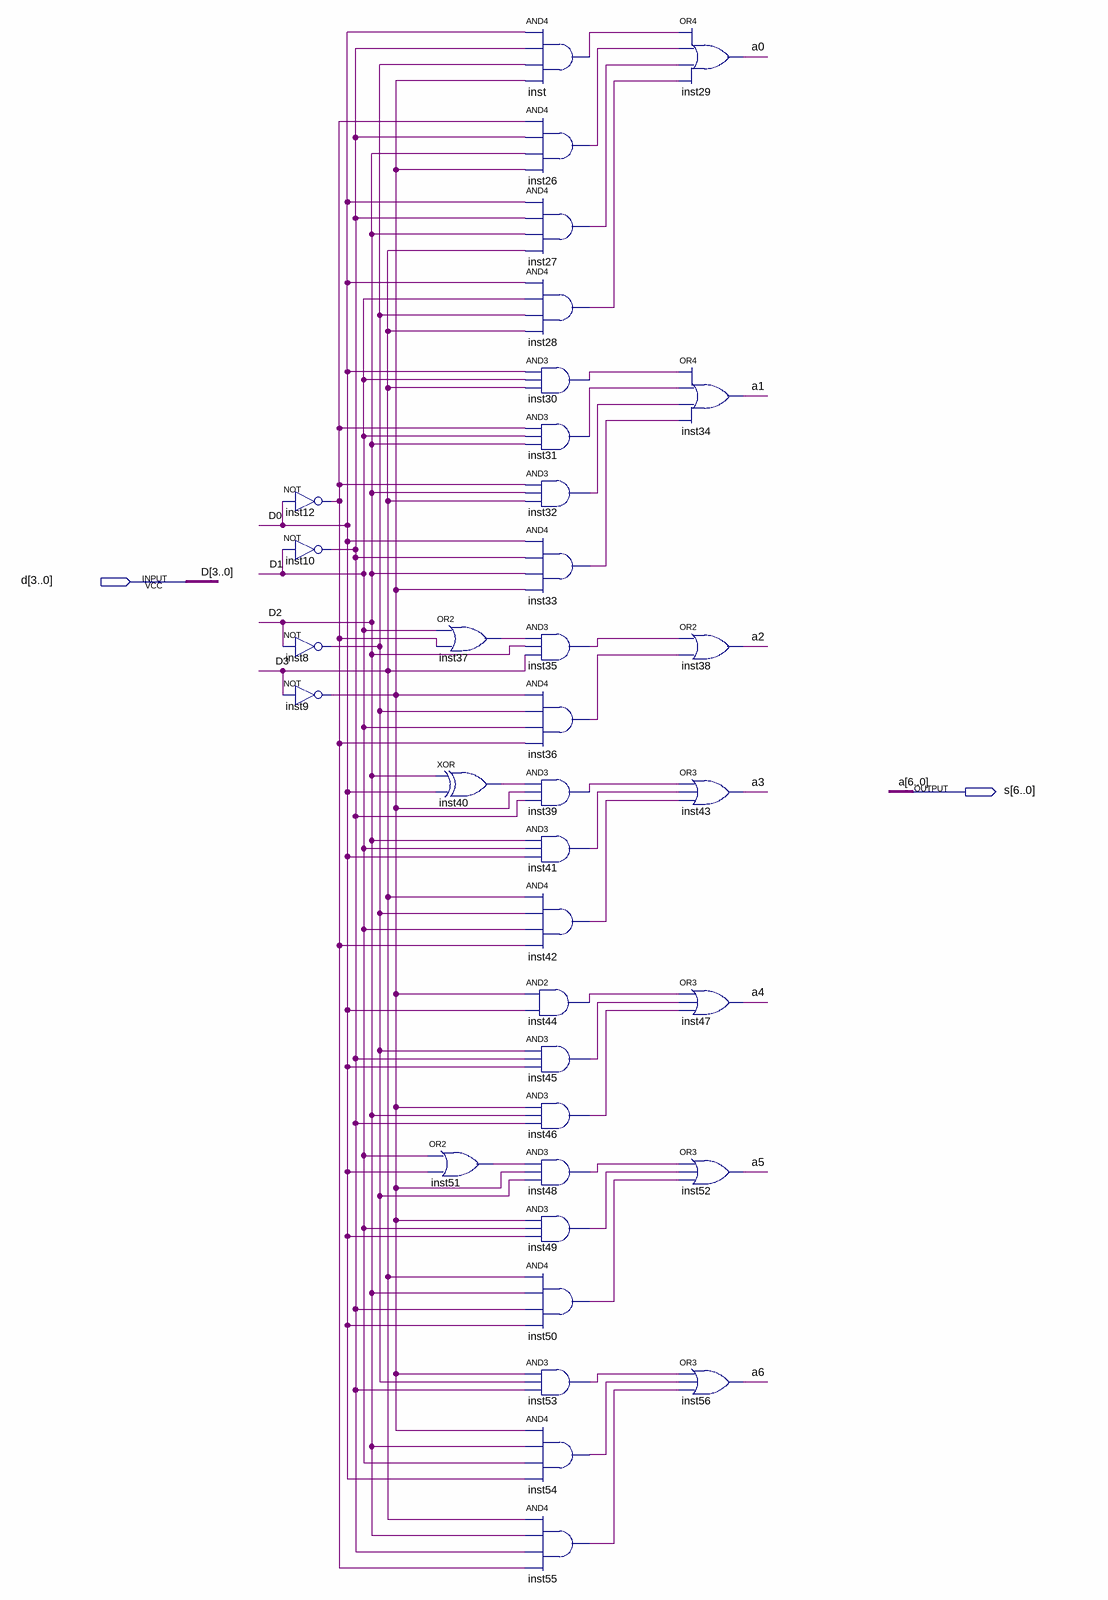
[diagram p0: schematic sheet]
// Quartus schematic display.bdf as structural Verilog: 36 symbols, 2 pins
module display (
  input  [3:0] d,
  output [6:0] s
);

  wire inst8_out, inst9_out, inst10_out, inst12_out, inst26_out, inst27_out, inst28_out, inst30_out,
       inst31_out, inst32_out, inst33_out, inst35_out, inst36_out, inst37_out, inst39_out, inst40_out,
       inst41_out, inst42_out, inst44_out, inst45_out, inst46_out, inst48_out, inst49_out, inst50_out,
       inst51_out, inst53_out, inst54_out, inst55_out, inst_out;

  not inst12 (inst12_out, d[0]);
  not inst10 (inst10_out, d[1]);
  not inst8 (inst8_out, d[2]);
  not inst9 (inst9_out, d[3]);
  or inst37 (inst37_out, d[1], inst12_out);
  xor inst40 (inst40_out, d[2], d[0]);
  or inst51 (inst51_out, d[1], d[0]);
  and inst (inst_out, d[0], inst10_out, inst8_out, inst9_out);
  and inst26 (inst26_out, inst12_out, inst10_out, d[2], inst9_out);
  and inst27 (inst27_out, d[0], inst10_out, d[2], d[3]);
  and inst28 (inst28_out, d[0], d[1], inst8_out, d[3]);
  and inst30 (inst30_out, d[0], d[1], d[3]);
  and inst31 (inst31_out, inst12_out, d[1], d[2]);
  and inst32 (inst32_out, inst12_out, d[2], d[3]);
  and inst33 (inst33_out, d[0], inst10_out, d[2], inst9_out);
  and inst35 (inst35_out, inst37_out, d[2], d[3]);
  and inst36 (inst36_out, inst9_out, inst8_out, d[1], inst12_out);
  and inst39 (inst39_out, inst40_out, inst9_out, inst10_out);
  and inst41 (inst41_out, d[2], d[1], d[0]);
  and inst42 (inst42_out, d[3], inst8_out, d[1], inst12_out);
  and inst44 (inst44_out, inst9_out, d[0]);
  and inst45 (inst45_out, inst8_out, inst10_out, d[0]);
  and inst46 (inst46_out, inst9_out, d[2], inst10_out);
  and inst48 (inst48_out, inst51_out, inst9_out, inst8_out);
  and inst49 (inst49_out, inst9_out, d[1], d[0]);
  and inst50 (inst50_out, d[3], d[2], inst10_out, d[0]);
  and inst53 (inst53_out, inst9_out, inst8_out, inst10_out);
  and inst54 (inst54_out, inst9_out, d[2], d[1], d[0]);
  and inst55 (inst55_out, d[3], d[2], inst10_out, inst12_out);
  or inst29 (s[0], inst_out, inst26_out, inst27_out, inst28_out);
  or inst34 (s[1], inst30_out, inst31_out, inst32_out, inst33_out);
  or inst38 (s[2], inst35_out, inst36_out);
  or inst43 (s[3], inst39_out, inst41_out, inst42_out);
  or inst47 (s[4], inst44_out, inst45_out, inst46_out);
  or inst52 (s[5], inst48_out, inst49_out, inst50_out);
  or inst56 (s[6], inst53_out, inst54_out, inst55_out);

  // Other names for the same wires on the sheet: a[6:0] = s; a0 = s[0]; a1 = s[1]; a2 = s[2]; a3 = s[3]; a4 = s[4];
  //   a5 = s[5]; a6 = s[6]
endmodule
